# Altium project G2_LV.PrjPcb
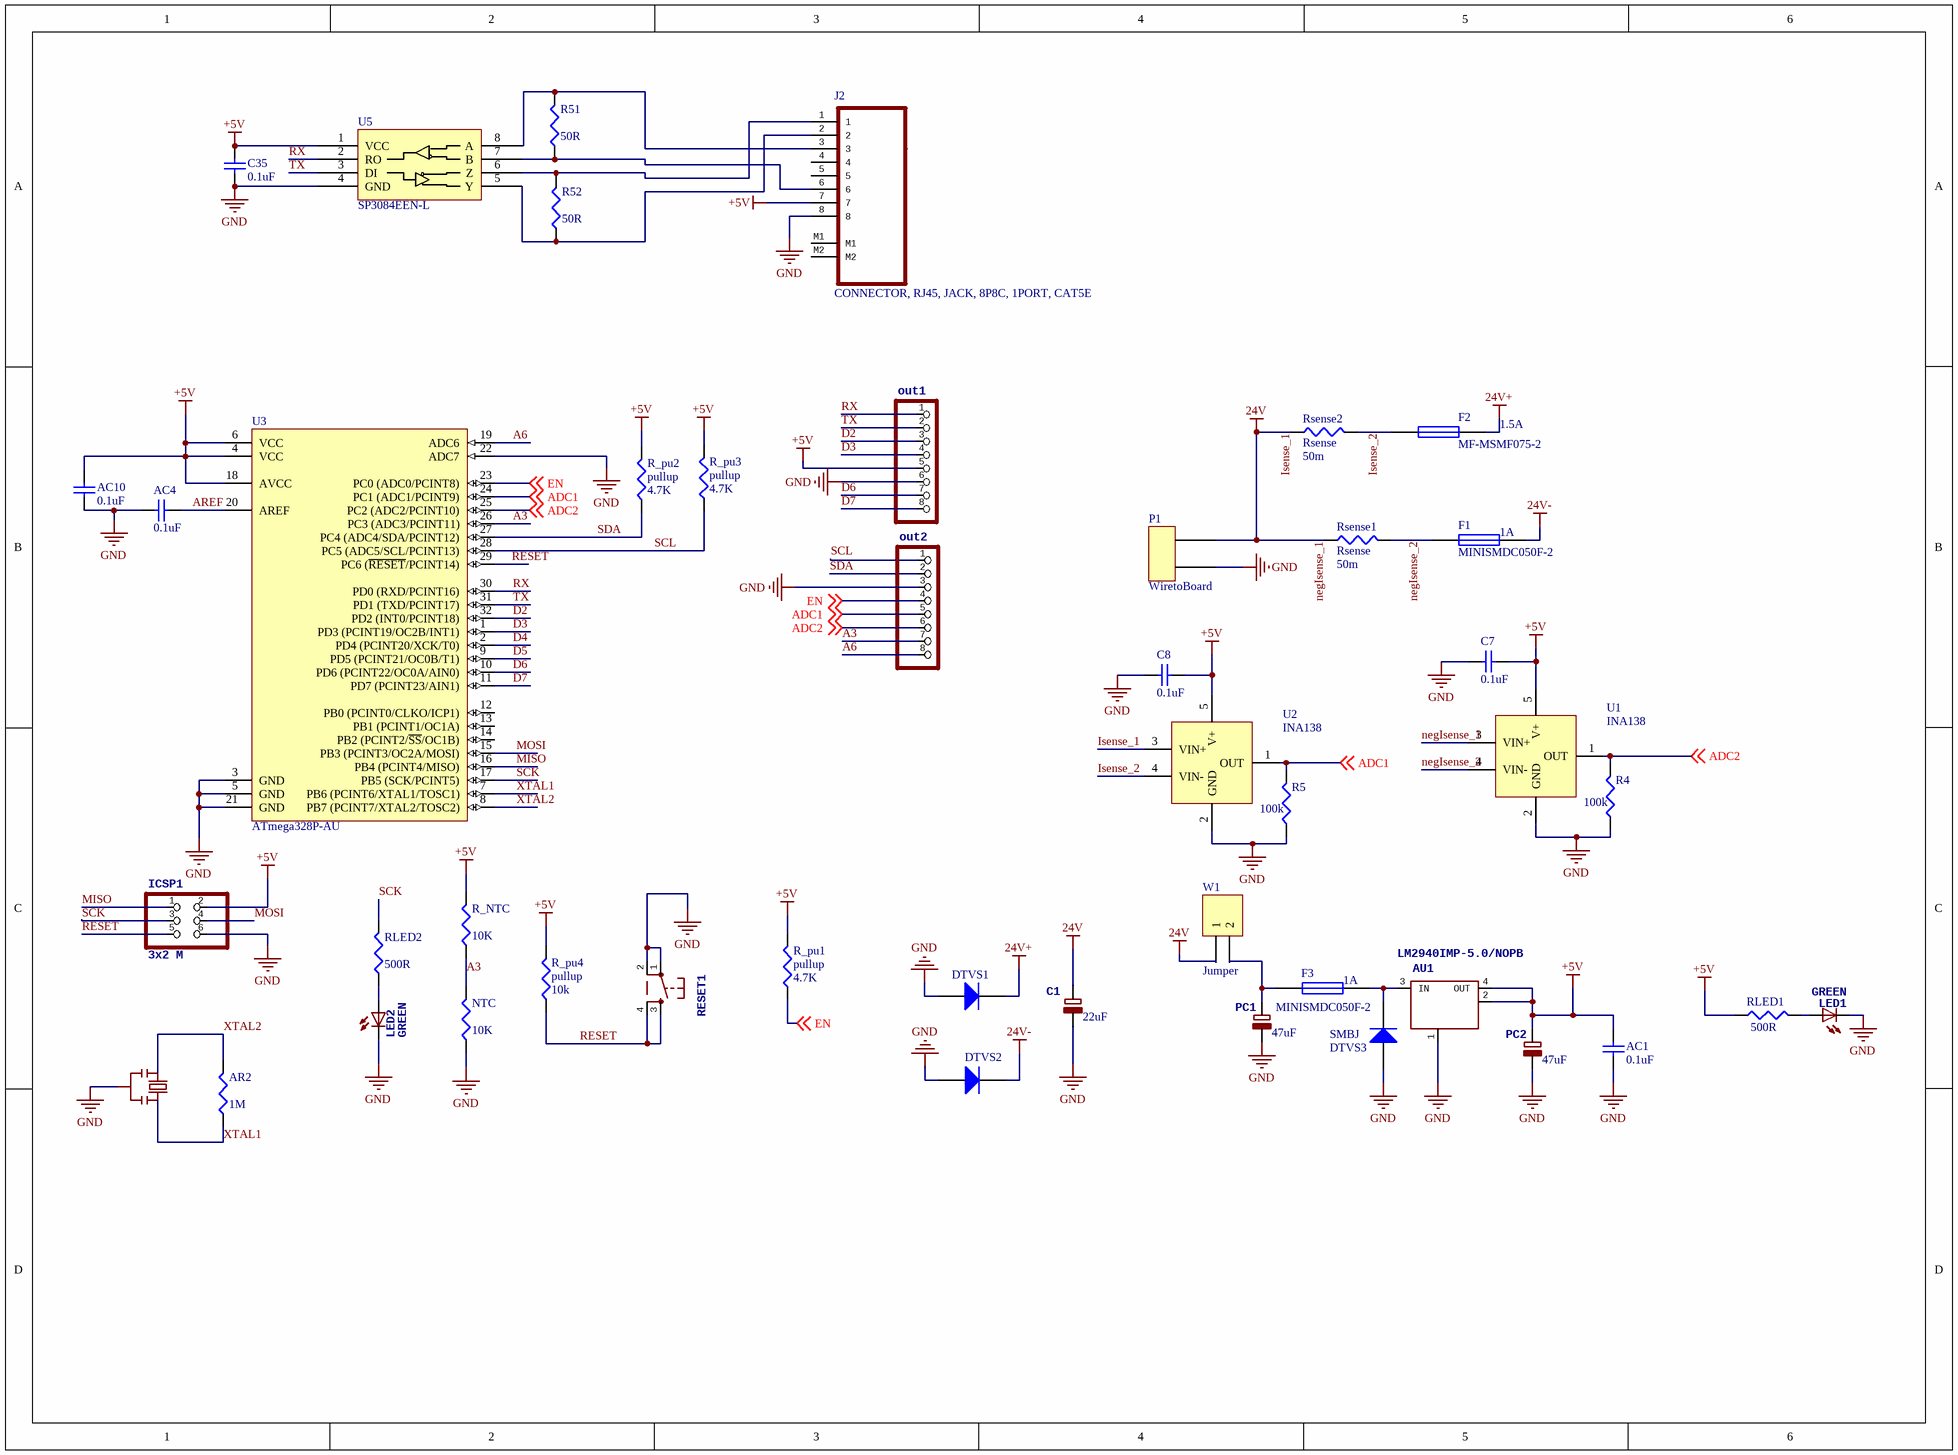
[diagram p0: controller.SchDoc]
2 sheets, 98 parts. Net scope: global (net labels, ports and power ports of the same name join across sheets).
Board files: 6C-2L-1550um.PcbDoc, LV1.PCBDOC
Sheets:
  controller.SchDoc
  LV1.schdoc

## Sheet controller.SchDoc
size 366 x 271 mm

### Parts
AC1  value 0.1uF  [1608[0603]]  (hidden comment: 100n)
AC4  value 0.1uF  [1608[0603]]  (hidden comment: Cap Semi)
AC10  value 0.1uF  [1608[0603]]  (hidden comment: Cap Semi)
AR2  value 1M  [J1-0603]
AU1  LM2940IMP-5.0/NOPB  [SOT223]
C1  value 22uF  [PANASONIC_D]
C7  value 0.1uF  [1608[0603]]  (hidden comment: Cap Semi)
C8  value 0.1uF  [1608[0603]]  (hidden comment: Cap Semi)
C35  value 0.1uF  [1608[0603]]  (hidden comment: Cap Semi)
DTVS1  SMBJ24A-E3/52  [DO-214AA]  (value not drawn)
DTVS2  SMBJ  [DO-214AA]  (value not drawn)
DTVS3  SMBJ  [DO-214AA]
F1  MINISMDC050F-2  Tripping current: 1A  [MF-MSMF1]
F2  MF-MSMF075-2  Tripping current: 1.5A  [MF-MSMF1]
F3  MINISMDC050F-2  Tripping current: 1A  [MF-MSMF1]
ICSP1  3x2 M  [2X03]
J2  CONNECTOR, RJ45, JACK, 8P8C, 1PORT, CAT5E  [MOLEX_85505-5113]
LED1  GREEN  [CHIP-LED0805]
LED2  GREEN  [CHIP-LED0805]
NTC  value 10K  [J1-0603]
out1  (no value)  [1X08]
out2  (no value)  [1X08]
P1  WiretoBoard  [MC000044]
PC1  value 47uF  [PANASONIC_D]  (hidden comment: <B>POLARIZED CAPACITOR</B>, European symbol)
PC2  value 47uF  [PANASONIC_D]  (hidden comment: <B>POLARIZED CAPACITOR</B>, European symbol)
R4  value 100k  [J1-0603]  (hidden comment: Res3)
R5  value 100k  [J1-0603]  (hidden comment: Res3)
R51  value 50R  [J1-0603]
R52  value 50R  [J1-0603]
R_NTC  value 10K  [J1-0603]
R_pu1  pullup  value 4.7K  [J1-0603]
R_pu2  pullup  value 4.7K  [J1-0603]
R_pu3  pullup  value 4.7K  [J1-0603]
R_pu4  pullup  value 10k  [J1-0603]
RESET1  (no value)  [B3S-1002]
RLED1  value 500R  [J1-0603]
RLED2  value 500R  [J1-0603]
Rsense1  Rsense  value 50m  [R6432]
Rsense2  Rsense  value 50m  [R6432]
U1  INA138  [SOT-23]
U2  INA138  [SOT-23]
U3  ATmega328P-AU  [32A_N]
U5  SP3084EEN-L  [SOICN8]
W1  Jumper  [HDR1X2]
Y1  (no value)  [RESONATOR]

### Nets
24V+: DTVS1.1(K) F2.2
24V-: DTVS2.1(K) F1.2
+5V: AC1.2 AC10.2 AU1.2(OUT) AU1.4(OUT) C7.2 C8.2 C35.2 ICSP1.2 J2.7 out1.5 PC2.1 R_NTC.2 R_pu1.2 R_pu2.2 R_pu3.2 R_pu4.2 RLED1.1 U1.5(V+) U2.5(V+) U3.4(VCC) U3.6(VCC) U3.18(AVCC) U5.1(VCC)
GND: AC1.1 AC4.1 AC10.1 AU1.1(GND/ADJ) C1.2 C7.1 C8.1 C35.1 DTVS1.2(A) DTVS2.2(A) DTVS3.2(A) ICSP1.6 J2.8 LED1.C LED2.C NTC.1 out1.6 out2.3 P1.2 PC1.2 PC2.2 R4.1 R5.1 RESET1.1 RESET1.2 U1.2(GND) U2.2(GND) U3.3(GND) U3.5(GND) U3.21(GND) U3.22(ADC7) U5.4(GND) Y1.2
Isense_1: C1.1 P1.1 Rsense1.1 Rsense2.1 U1.3(VIN+) U2.3(VIN+) W1.1  [also labelled 24V, negIsense_1]
A3: NTC.2 out2.7 R_NTC.1 U3.26(PC3_(ADC3/PCINT11))
A6: out2.8 U3.19(ADC6)
ADC1: out2.5 R5.2 U2.1(OUT) U3.24(PC1_(ADC1/PCINT9)) ; off-sheet ADC1
ADC2: out2.6 R4.2 U1.1(OUT) U3.25(PC2_(ADC2/PCINT10)) ; off-sheet ADC2
AREF: AC4.2 U3.20(AREF)
D2: out1.3 U3.32(PD2_(INT0/PCINT18))
D3: out1.4 U3.1(PD3_(PCINT19/OC2B/INT1))
D4: U3.2(PD4_(PCINT20/XCK/T0))
D5: U3.9(PD5_(PCINT21/OC0B/T1))
D6: out1.7 U3.10(PD6_(PCINT22/OC0A/AIN0))
D7: out1.8 U3.11(PD7_(PCINT23/AIN1))
EN: out2.4 R_pu1.1 U3.23(PC0_(ADC0/PCINT8)) ; off-sheet EN
Isense_2: F2.1 Rsense2.2 U2.4(VIN-)
MISO: ICSP1.1 U3.16(PB4_(PCINT4/MISO))
MOSI: ICSP1.4 U3.15(PB3_(PCINT3/OC2A/MOSI))
negIsense_2: F1.1 Rsense1.2 U1.4(VIN-)
RESET: ICSP1.5 R_pu4.1 RESET1.3 RESET1.4 U3.29(PC6_(~{RESET}/PCINT14))
RX: out1.1 U3.30(PD0_(RXD/PCINT16)) U5.2(RO)
SCK: ICSP1.3 RLED2.2 U3.17(PB5_(SCK/PCINT5))
SCL: out2.1 R_pu3.1 U3.28(PC5_(ADC5/SCL/PCINT13))
SDA: out2.2 R_pu2.1 U3.27(PC4_(ADC4/SDA/PCINT12))
TX: out1.2 U3.31(PD1_(TXD/PCINT17)) U5.3(DI)
XTAL1: AR2.1 U3.7(PB6_(PCINT6/XTAL1/TOSC1)) Y1.3
XTAL2: AR2.2 U3.8(PB7_(PCINT7/XTAL2/TOSC2)) Y1.1
NetAU1_3: AU1.3(IN) DTVS3.1(K) F3.2
NetF3_1: F3.1 PC1.1 W1.2
NetJ2_1: J2.1 R52.2 U5.6(Z)
NetJ2_2: J2.2 R52.1 U5.5(Y)
NetJ2_3: J2.3 R51.2 U5.8(A)
NetJ2_6: J2.6 R51.1 U5.7(B)
NetLED1_A: LED1.A RLED1.2
NetLED2_A: LED2.A RLED2.1

Not connected (* = marked no-connect by the designer): J2 4 5 M1 M2; U3 12(PB0_(PCINT0/CLKO/ICP1)) 13(PB1_(PCINT1/OC1A)) 14(PB2_(PCINT2/~{SS}/OC1B))

### Library data of the parts
AC1 AC4 AC10 C7 C8 C35 = Cap Semi: Capacitor (Semiconductor SIM Model); PartNo: CC0603KRX7R9BB104; Published: 8-Jun-2000; LatestRevisionDate: 29-May-2009; LatestRevisionNote: IPC-7351 Footprint Added.; PackageReference: C1206; Publisher: Altium Limited; PackageDescription: Chip Capacitor
AR2 R4 R5 R51 R52 R_NTC R_pu1-R_pu4 RLED1 RLED2 = Res3: Resistor; Published: 8-Jun-2000; LatestRevisionDate: 29-May-2009; LatestRevisionNote: IPC-7351 Footprint Added.; PackageReference: J1-0603; Publisher: Altium Limited; PackageDescription: Chip Resistor
AU1 = MC33269ST*: 1469076; PartNo: LM2940IMP-5.0/NOPB
C1 = CPOL-EUD: PartNo: EMZA500ADA220MF61G
DTVS1 = SMBJ: TVS; Note: Pin 2 is not connected and not drawn.; Published: 21-Mar-2003; LatestRevisionDate: 29-May-2009; LatestRevisionNote: IPC-7351 Footprint Added.; DatasheetVersion: Oct-1999; PackageVersion: Sep-2001; PackageReference: SOT-23; Publisher: Altium Limited; PackageDescription: 3-Pin SOT-23 Package 0.95 mm Pitch, 2.5 mm Lead Span; ComponentLink1Description: Manufacturer Link; ComponentLink1URL: http://www.infineon.com/; ComponentLink2Description: Datasheet; ComponentLink2URL: http://www.infineon.com/upload/Document/cmc_upload/documents/080/656/bas116series.pdf; PartNo: SMBJ24A-E3/52
DTVS2 DTVS3 = SMBJ: TVS; PartNo: SMBJ24A-E3/52; Note: Pin 2 is not connected and not drawn.; Published: 21-Mar-2003; LatestRevisionDate: 29-May-2009; LatestRevisionNote: IPC-7351 Footprint Added.; DatasheetVersion: Oct-1999; PackageVersion: Sep-2001; PackageReference: SOT-23; Publisher: Altium Limited; PackageDescription: 3-Pin SOT-23 Package 0.95 mm Pitch, 2.5 mm Lead Span; ComponentLink1Description: Manufacturer Link; ComponentLink1URL: http://www.infineon.com/; ComponentLink2Description: Datasheet; ComponentLink2URL: http://www.infineon.com/upload/Document/cmc_upload/documents/080/656/bas116series.pdf
F1 F3 = Fuse 1: Fuse; Published: 8-Jun-2000; LatestRevisionDate: 17-Jul-2002; LatestRevisionNote: Re-released for DXP Platform.; PackageReference: PIN-W2/E2.8; Publisher: Altium Limited; PackageDescription: Thru-Hole; 2 Leads; PartNo: MINISMDC050F-2
F2 = Fuse 1: Fuse; PartNo: MF-MSMF075/24-2; Published: 8-Jun-2000; LatestRevisionDate: 17-Jul-2002; LatestRevisionNote: Re-released for DXP Platform.; PackageReference: PIN-W2/E2.8; Publisher: Altium Limited; PackageDescription: Thru-Hole; 2 Leads
ICSP1 = PINHD-2X3: PartNo: M20-9980345
J2 = 85505-5113: MPN: 85505-5113; OC_FARNELL: 1560163; OC_NEWARK: 96M8715; PACKAGE: RJ45, JACK, 8P8C; SUPPLIER: Molex
LED1 LED2 = LEDCHIP-LED0805: PartNo: KPT-2012SGC
NTC = Res3: Resistor; PartNo: NCP18XH103J03RB; Published: 8-Jun-2000; LatestRevisionDate: 29-May-2009; LatestRevisionNote: IPC-7351 Footprint Added.; PackageReference: J1-0603; Publisher: Altium Limited; PackageDescription: Chip Resistor
out1 out2 = PINHD-1X8: PartNo: 5-534237-4
P1 = WiretoBoard: PartNo: 64T3402; Supplier 1: Newark; Supplier Part Number 1: 64T3402
PC1 PC2 = CPOL-EUD: PartNo: EEE1EA470WAP
RESET1 = TS42: PartNo: B3S-1002
Rsense1 Rsense2 = Rsense: CRF2512-FV-R001ELF; PartNo: MCS3264R050FER; Published: 8-Jun-2000; LatestRevisionDate: 29-May-2009; LatestRevisionNote: IPC-7351 Footprint Added.; PackageReference: J1-0603; Publisher: Altium Limited; PackageDescription: Chip Resistor
U1 U2 = INA138: PartNo: INA138NA/250
U3 = ATmega328P-AU: 8-bit AVR Microcontroller, 32KB Flash, 1KB EEPROM, 2KB SRAM, 32-pin TQFP, Industrial Grade (-40°C to 85°C); DatasheetVersion: revD, May-2011; PackageVersion: revC, Oct-2010; PackageReference: 32A; PackageDescription: 32-Lead, 7x7x1.0 mm Body, 0.8mm Lead Pitch, Thin Profile Plastic Quad Flat Package (TQFP); Code_JEDEC: MS-026-ABA; ComponentLink1Description: Manufacturer URL; ComponentLink1URL: http://www.atmel.com/; ComponentLink2Description: ATmega48A/48PA/88A/88PA/168A/168PA/328/328P Datasheet; ComponentLink2URL: http://www.atmel.com/dyn/resources/prod_documents/doc8271.pdf; ComponentLink3Description: ATmega48A/48PA/88A/88PA/168A/168PA/328/328P Summary; ComponentLink3URL: http://www.atmel.com/dyn/resources/prod_documents/8271S.pdf; PartNo: ATmega328P-AU
W1 = Header 2: Header, 2-Pin; LatestRevisionDate: 17-Jul-2002; LatestRevisionNote: Re-released for DXP Platform.; Publisher: Altium Limited
Y1 = RESONATORMU: PartNo: CSTCE16M0V53-R0
U5 = SP3084EEN-L: PartNo: SP3084EEN-L

## Sheet LV1.schdoc: Eurocard VME 3U (3.937 x 6.299 inches)
size A; Organization: Organization; Address1: Address1; Address2: Address2; Address3: Address3; Address4: Address4; DocumentNumber: 1; Revision: 0; SheetNumber: 2; SheetTotal: 2
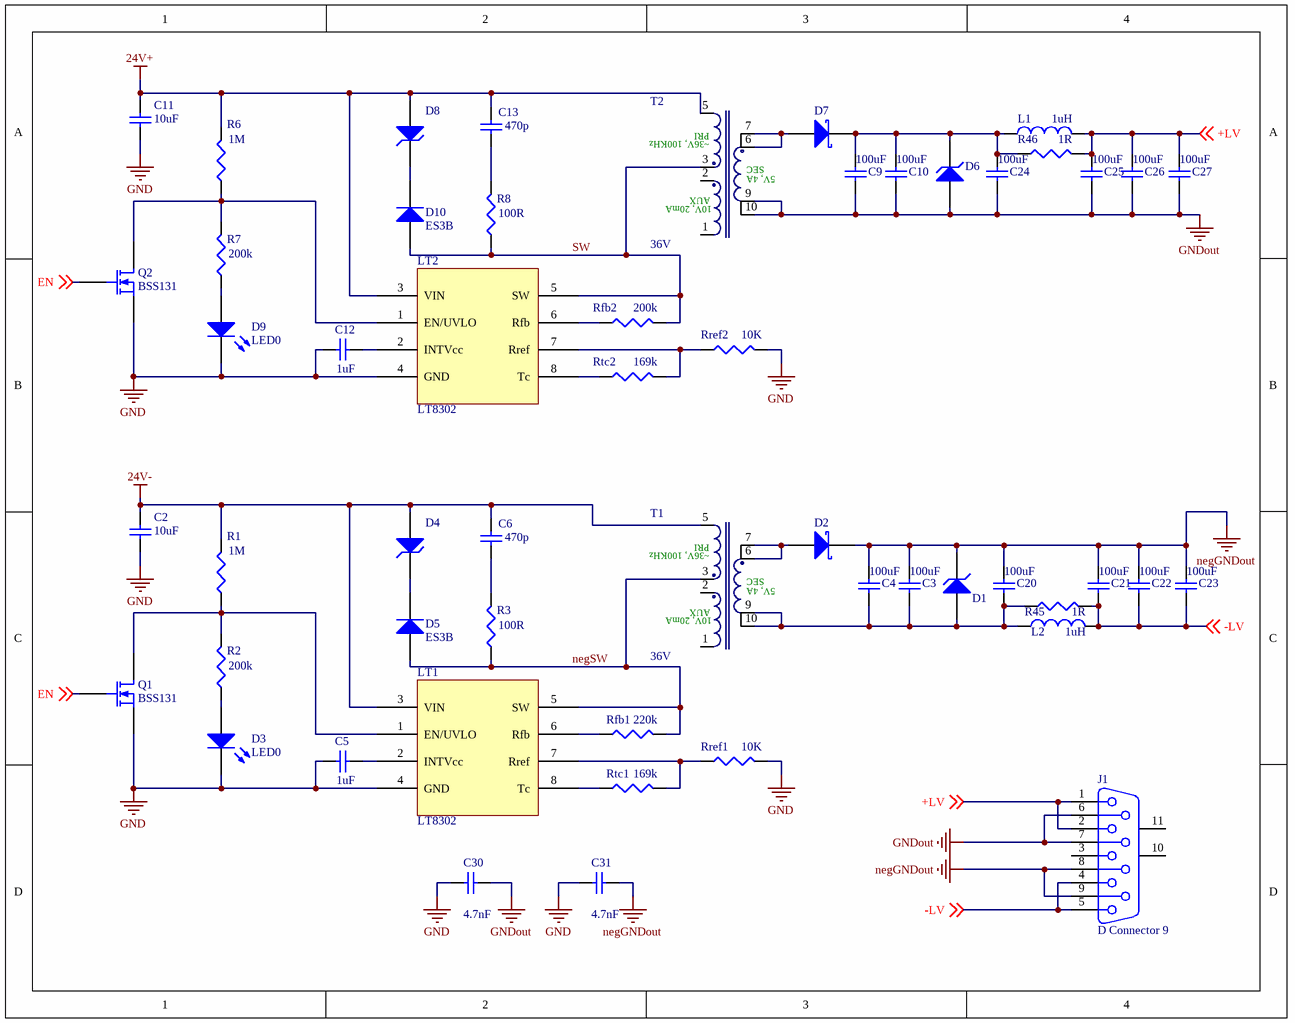
[diagram p1: LV1.schdoc]

### Parts
C2  value 10uF  [C1210]  (hidden comment: Cap Semi)
C3  value 100uF  [C1210]  (hidden comment: Cap Semi)
C4  value 100uF  [C1210]  (hidden comment: Cap Semi)
C5  value 1uF  [1608[0603]]  (hidden comment: Cap Semi)
C6  value 470p  [C0805]  (hidden comment: Cap Semi)
C9  value 100uF  [C1210]  (hidden comment: Cap Semi)
C10  value 100uF  [C1210]  (hidden comment: Cap Semi)
C11  value 10uF  [C1210]  (hidden comment: Cap Semi)
C12  value 1uF  [1608[0603]]  (hidden comment: Cap Semi)
C13  value 470p  [C0805]  (hidden comment: Cap Semi)
C20  value 100uF  [C1210]  (hidden comment: Cap Semi)
C21  value 100uF  [C1210]  (hidden comment: Cap Semi)
C22  value 100uF  [C1210]  (hidden comment: Cap Semi)
C23  value 100uF  [C1210]  (hidden comment: Cap Semi)
C24  value 100uF  [C1210]  (hidden comment: Cap Semi)
C25  value 100uF  [C1210]  (hidden comment: Cap Semi)
C26  value 100uF  [C1210]  (hidden comment: Cap Semi)
C27  value 100uF  [C1210]  (hidden comment: Cap Semi)
C30  value 4.7nF  [1812]  (hidden comment: Cap Semi)
C31  value 4.7nF  [1812]  (hidden comment: Cap Semi)
D1  BZT52H-B5V6  [SOD123F]  (value not drawn)
D2  PDS1040L  [PDS1040L]  (value not drawn)
D3  LED0  [LED-0]
D4  SMAJ30A  [DO-214AC]  (value not drawn)
D5  ES3B  [DO-214AB]
D6  BZT52H-B5V6  [SOD123F]  (value not drawn)
D7  PDS1040L  [PDS1040L]  (value not drawn)
D8  SMAJ30A  [DO-214AC]  (value not drawn)
D9  LED0  [LED-0]
D10  ES3B  [DO-214AB]
J1  D Connector 9  [DSUB1.385-2H9]
L1  value 1uH  [MPLC0730]  (hidden comment: Inductor)
L2  value 1uH  [MPLC0730]  (hidden comment: Inductor)
LT1  LT8302  [S8E]
LT2  LT8302  [S8E]
Q1  BSS131  [SOT-23]
Q2  BSS131  [SOT-23]
R1  value 1M  [J1-0603]  (hidden comment: Res3)
R2  value 200k  [J1-0603]  (hidden comment: Res3)
R3  value 100R  [C1206]  (hidden comment: Res3)
R6  value 1M  [J1-0603]  (hidden comment: Res3)
R7  value 200k  [J1-0603]  (hidden comment: Res3)
R8  value 100R  [C1206]  (hidden comment: Res3)
R45  value 1R  [J1-0603]  (hidden comment: Res3)
R46  value 1R  [J1-0603]  (hidden comment: Res3)
Rfb1  value 220k  [J1-0603]  (hidden comment: Res3)
Rfb2  value 200k  [J1-0603]  (hidden comment: Res3)
Rref1  value 10K  [J1-0603]  (hidden comment: Res3)
Rref2  value 10K  [J1-0603]  (hidden comment: Res3)
Rtc1  value 169k  [J1-0603]  (hidden comment: Res3)
Rtc2  value 169k  [J1-0603]  (hidden comment: Res3)
T1  36V  [EP13]
T2  36V  [EP13]

### Nets
24V+: C11.2 C13.2 D8.1(A) LT2.3(VIN) R6.2 T2.5
24V-: C2.2 C6.2 D4.1(A) LT1.3(VIN) R1.2 T1.5
GND: C2.1 C5.2 C11.1 C12.2 C30.1 C31.1 D3.2(K) D9.2(K) LT1.4(GND) LT2.4(GND) Q1.2(S) Q2.2(S) Rref1.2 Rref2.2
GNDout: C9.1 C10.1 C24.1 C25.1 C26.1 C27.1 C30.2 D6.1(A) J1.6 J1.7 T2.9 T2.10
negGNDout: C3.2 C4.2 C20.2 C21.2 C22.2 C23.2 C31.2 D1.2(K) D2.2(K) J1.8 J1.9
+LV: C25.2 C26.2 C27.2 J1.1 J1.2 L1.2 R46.2 ; off-sheet +LV
-LV: C21.1 C22.1 C23.1 J1.4 J1.5 L2.2 R45.2 ; off-sheet -LV
EN: Q1.1(G) Q2.1(G) ; off-sheet EN
negSW: D5.2(A) LT1.5(SW) R3.1 Rfb1.2 T1.3
SW: D10.2(A) LT2.5(SW) R8.1 Rfb2.2 T2.3
NetC3_1: C3.1 C4.1 C20.1 D1.1(A) L2.1 R45.1 T1.9 T1.10
NetC5_1: C5.1 LT1.2(INTVcc)
NetC6_1: C6.1 R3.2
NetC9_2: C9.2 C10.2 C24.2 D6.2(K) D7.2(K) L1.1 R46.1
NetC12_1: C12.1 LT2.2(INTVcc)
NetC13_1: C13.1 R8.2
NetD2_1: D2.1(A) T1.6 T1.7
NetD3_1: D3.1(A) R2.1
NetD4_2: D4.2(K) D5.1(K)
NetD7_1: D7.1(A) T2.6 T2.7
NetD8_2: D8.2(K) D10.1(K)
NetD9_1: D9.1(A) R7.1
NetLT1_1: LT1.1(EN/UVLO) Q1.3(D) R1.1 R2.2
NetLT1_6: LT1.6(Rfb) Rfb1.1
NetLT1_7: LT1.7(Rref) Rref1.1 Rtc1.2
NetLT1_8: LT1.8(Tc) Rtc1.1
NetLT2_1: LT2.1(EN/UVLO) Q2.3(D) R6.1 R7.2
NetLT2_6: LT2.6(Rfb) Rfb2.1
NetLT2_7: LT2.7(Rref) Rref2.1 Rtc2.2
NetLT2_8: LT2.8(Tc) Rtc2.1

Not connected (* = marked no-connect by the designer): J1 3 10(MH1) 11(MH2); T1 1 2; T2 1 2

### Notes on the sheet
- (in symbol WE-FB, 750311457) PRI; ~36V, 100KHz; SEC; 5V, 4A; AUX; 10V, 20mA

### Library data of the parts
C2 = Cap Semi: PartNo: UMK325BJ106KM-T; Published: 8-Jun-2000; LatestRevisionDate: 29-May-2009; LatestRevisionNote: IPC-7351 Footprint Added.; PackageReference: C1206; Publisher: Altium Limited; PackageDescription: Chip Capacitor
C3 C4 C9 C10 C20 C24 = Cap Semi: Capacitor (Semiconductor SIM Model); PartNo: C3225X5R0J107M250AC; Published: 8-Jun-2000; LatestRevisionDate: 29-May-2009; LatestRevisionNote: IPC-7351 Footprint Added.; PackageReference: C1206; Publisher: Altium Limited; PackageDescription: Chip Capacitor
C5 C12 = Cap Semi: Capacitor (Semiconductor SIM Model); PartNo: 06033D105KAT2A; Published: 8-Jun-2000; LatestRevisionDate: 29-May-2009; LatestRevisionNote: IPC-7351 Footprint Added.; PackageReference: C1206; Publisher: Altium Limited; PackageDescription: Chip Capacitor
C6 = Cap Semi: PartNo: 08055A221JAT2A; Published: 8-Jun-2000; LatestRevisionDate: 29-May-2009; LatestRevisionNote: IPC-7351 Footprint Added.; PackageReference: C1206; Publisher: Altium Limited; PackageDescription: Chip Capacitor
C11 = Cap Semi: Capacitor (Semiconductor SIM Model); PartNo: UMK325BJ106KM-T; Published: 8-Jun-2000; LatestRevisionDate: 29-May-2009; LatestRevisionNote: IPC-7351 Footprint Added.; PackageReference: C1206; Publisher: Altium Limited; PackageDescription: Chip Capacitor
C13 = Cap Semi: Capacitor (Semiconductor SIM Model); PartNo: 08055A221JAT2A; Published: 8-Jun-2000; LatestRevisionDate: 29-May-2009; LatestRevisionNote: IPC-7351 Footprint Added.; PackageReference: C1206; Publisher: Altium Limited; PackageDescription: Chip Capacitor
C21-C23 C25-C27 = Cap Semi: Capacitor (Semiconductor SIM Model); PartNo: CL32A107MPVNNNE; Published: 8-Jun-2000; LatestRevisionDate: 29-May-2009; LatestRevisionNote: IPC-7351 Footprint Added.; PackageReference: C1206; Publisher: Altium Limited; PackageDescription: Chip Capacitor
C30 C31 = Cap Semi: Capacitor (Semiconductor SIM Model); PartNo: C1812C472KDRACTU; Published: 8-Jun-2000; LatestRevisionDate: 29-May-2009; LatestRevisionNote: IPC-7351 Footprint Added.; PackageReference: C1206; Publisher: Altium Limited; PackageDescription: Chip Capacitor
D1 D6 = BZT52H-B5V6: Zener Diode; pin to pad: 1>2 2>1; Published: 8-Jun-2000; LatestRevisionDate: 17-Jul-2002; LatestRevisionNote: Re-released for DXP Platform.; PackageReference: DIODE-0.7; Publisher: Altium Limited; PackageDescription: Diode, Thru-Hole; 2 Leads; 0.7 in Pin Spacing; PartNo: BZT52H-B5V6
D2 D7 = PDS1040L: Schottky Diode; PartNo: PDS1040L-13; Published: 8-Jun-2000; LatestRevisionDate: 17-Jul-2002; LatestRevisionNote: Re-released for DXP Platform.; PackageReference: SMC; Publisher: Altium Limited; Code_JEDEC: DO-214-AA
D3 D9 = LED0: Typical INFRARED GaAs LED; Published: 8-Jun-2000; LatestRevisionDate: 08-Jul-2005; LatestRevisionNote: Mech Layer 1 removed.; PackageReference: LED-0; Publisher: Altium Limited; PackageDescription: LED; 2 Leads
D4 D8 = D Zener: Zener Diode; Published: 8-Jun-2000; LatestRevisionDate: 17-Jul-2002; LatestRevisionNote: Re-released for DXP Platform.; PackageReference: DIODE-0.7; Publisher: Altium Limited; PackageDescription: Diode, Thru-Hole; 2 Leads; 0.7 in Pin Spacing; PartNo: SMAJ30A
D5 D10 = ES3B: Power Diode; Note: Pin 2 is not connected and not drawn.; Published: 21-Mar-2003; LatestRevisionDate: 29-May-2009; LatestRevisionNote: IPC-7351 Footprint Added.; DatasheetVersion: Oct-1999; PackageVersion: Sep-2001; PackageReference: SOT-23; Publisher: Altium Limited; PackageDescription: 3-Pin SOT-23 Package 0.95 mm Pitch, 2.5 mm Lead Span; ComponentLink1Description: Manufacturer Link; ComponentLink1URL: http://www.infineon.com/; ComponentLink2Description: Datasheet; ComponentLink2URL: http://www.infineon.com/upload/Document/cmc_upload/documents/080/656/bas116series.pdf; PartNo: ES3B
J1 = D Connector 9: Receptacle Assembly, 9 Position, Right Angle; PartNo: 1734354-1; PackageDocument: O; Positions: 9; Published: 15-Jun-2001; LatestRevisionDate: 17-Jul-2002; LatestRevisionNote: Re-released for DXP Platform.; DatasheetDocument: 1-Sep-1999; PackageReference: 788750; Publisher: Altium Limited; Orientation: Right Angle; Gender: Receptacle
L1 L2 = Inductor: PartNo: MPLC0730L1R0; Code_IEC: 1005; Published: 8-Jun-2000; LatestRevisionDate: 29-May-2009; LatestRevisionNote: IPC-7351 Footprint Added.; PackageReference: 0402-A; Publisher: Altium Limited; PackageDescription: Chip Inductor; Code_JEITA: 0402
LT1 LT2 = LT8302: PartNo: LT8302ES8E#PBF
Q1 Q2 = BSS131: N-Channel MOSFET; Published: 8-Jun-2000; LatestRevisionDate: 17-Jul-2002; LatestRevisionNote: Re-released for DXP Platform.; PackageVersion: 1995/1996; PackageReference: E3; Publisher: Altium Limited; PackageDescription: TO, Flat Index; 3 In-Line, Axial Leads; Body Dia. 4.6mm; Lead Dia. 0.5 mm (max); PartNo: BSS131
R1-R3 R6-R8 R45 R46 Rfb1 Rfb2 Rref1 Rref2 Rtc1 Rtc2 = Res3: Resistor; Published: 8-Jun-2000; LatestRevisionDate: 29-May-2009; LatestRevisionNote: IPC-7351 Footprint Added.; PackageReference: J1-0603; Publisher: Altium Limited; PackageDescription: Chip Resistor
T1 = WE-FB, 750311457: Flyback Transformer; Manufacturer: Würth Elektronik eiSos GmbH; PartNo: 750311457; Ui: 36V; ComponentLink1Description: Manufacturer; ComponentLink1URL: http://www.we-online.de; Created by: Otto Christin; Created Date: OCT 2013; ComponentLink2Description: Datasheet; ComponentLink2URL: http://katalog.we-online.de/pbs/datasheet/750311457.pdf
T2 = WE-FB, 750311457: Flyback Transformer suitable or LT3573/ LT3574/ LT3575/ LT3748 WE-FB, Ui=36V; Manufacturer: Würth Elektronik eiSos GmbH; PartNo: 750311457; Ui: 36V; ComponentLink1Description: Manufacturer; ComponentLink1URL: http://www.we-online.de; Created by: Otto Christin; Created Date: OCT 2013; ComponentLink2Description: Datasheet; ComponentLink2URL: http://katalog.we-online.de/pbs/datasheet/750311457.pdf

## Nets that join several sheets
24V+: controller (DTVS1.1 F2.2), LV1 (6 pins)
24V-: controller (DTVS2.1 F1.2), LV1 (6 pins)
GND: controller (33 pins), LV1 (14 pins)
EN: controller (out2.4 R_pu1.1 U3.23), LV1 (Q1.1 Q2.1)